# EAGLE design esp8266-somfy-switching (EAGLE 9.6.2)
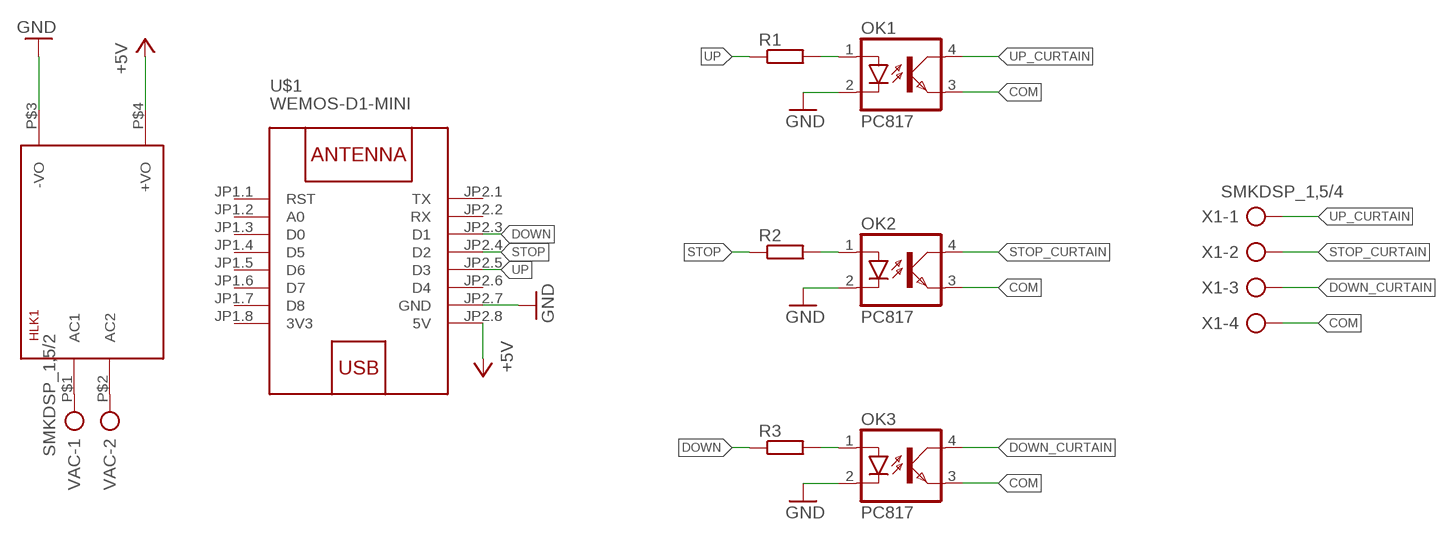
[diagram p0: schematic, sheet 1]

## Parts
HLK1  HLK-PM013W  [HLK-PM01]
OK1  PC817  [DIL04]
OK2  PC817  [DIL04]
OK3  PC817  [DIL04]
R1  R-EU_0207/10  [0207/10]
R2  R-EU_0207/10  [0207/10]
R3  R-EU_0207/10  [0207/10]
U$1  WEMOS-D1-MINI  [WEMOS-D1-MINI]
VAC  SMKDSP_1,5/2  [SMKDSP_1,5/2]
X1  SMKDSP_1,5/4  [SMKDSP_1,5/4]

## Nets
+5V: HLK1.P$4(+VO) U$1.JP2.8(5V)
COM: OK1.3(EMIT) OK2.3(EMIT) OK3.3(EMIT) X1.4
DOWN: R3.1 U$1.JP2.3(D1)
DOWN_CURTAIN: OK3.4(COL) X1.3
GND: HLK1.P$3(-VO) OK1.2(C) OK2.2(C) OK3.2(C) U$1.JP2.7(GND)
N$1: HLK1.P$1(AC1) VAC.1
N$2: HLK1.P$2(AC2) VAC.2
N$3: OK1.1(A) R1.2
N$11: OK2.1(A) R2.2
N$14: OK3.1(A) R3.2
STOP: R2.1 U$1.JP2.4(D2)
STOP_CURTAIN: OK2.4(COL) X1.2
UP: R1.1 U$1.JP2.5(D3)
UP_CURTAIN: OK1.4(COL) X1.1
Unconnected: U$1.JP1.1(RST) U$1.JP1.2(A0) U$1.JP1.3(D0) U$1.JP1.4(D5) U$1.JP1.5(D6) U$1.JP1.6(D7) U$1.JP1.7(D8) U$1.JP2.1(TX) U$1.JP2.2(RX) U$1.JP2.6(D4)

## Power pins joined to a net without a drawn wire
3V3: U$1.JP1.8(3V3)

## Library data of the parts
HLK1 = HLK-PM01:HLK-PM01: Hi-Link Power Supply HLK-PM01 3W Author: Ahmed Said <https://github.com/AhmedSaid/EAGLELibraries>
OK1-OK3 = optocoupler:PC817: SHARP OPTO COUPLER; MPN: PC817X4J000F; OC_FARNELL: 9707727; OC_NEWARK: 97K7059
R1-R3 = resistor:R-EU_: RESISTOR, European symbol
U$1 = diy-modules:WEMOS-D1-MINI: WEMOS D1 mini: Mini Wi-Fi Board based on ESP-8266 device More details can be found here: https://www.wemos.cc/product/d1-mini.html Click here to find device on ebay.com <http://www.ebay.com/sch/wemos+d1+mini+nodemcu>
VAC = con-phoenix-smkdsp:SMKDSP_1,5/2: Printklemme, Nennstrom: 17,5 A, Bemessungsspannung: 250 V, Raster: 5,0 mm Source: http://eshop.phoenixcontact.de .. 1733415.pdf; MF: FARNELL; MPN: 1733570; OC_FARNELL: 3041244; OC_NEWARK: 69C8588
X1 = con-phoenix-smkdsp:SMKDSP_1,5/4: Printklemme, Nennstrom: 17,5 A, Bemessungsspannung: 250 V, Raster: 5,0 mm Source: http://eshop.phoenixcontact.de .. 1733415.pdf; MF: FARNELL; MPN: 1733596; OC_FARNELL: 3041268; OC_NEWARK: 71C4131

## Board
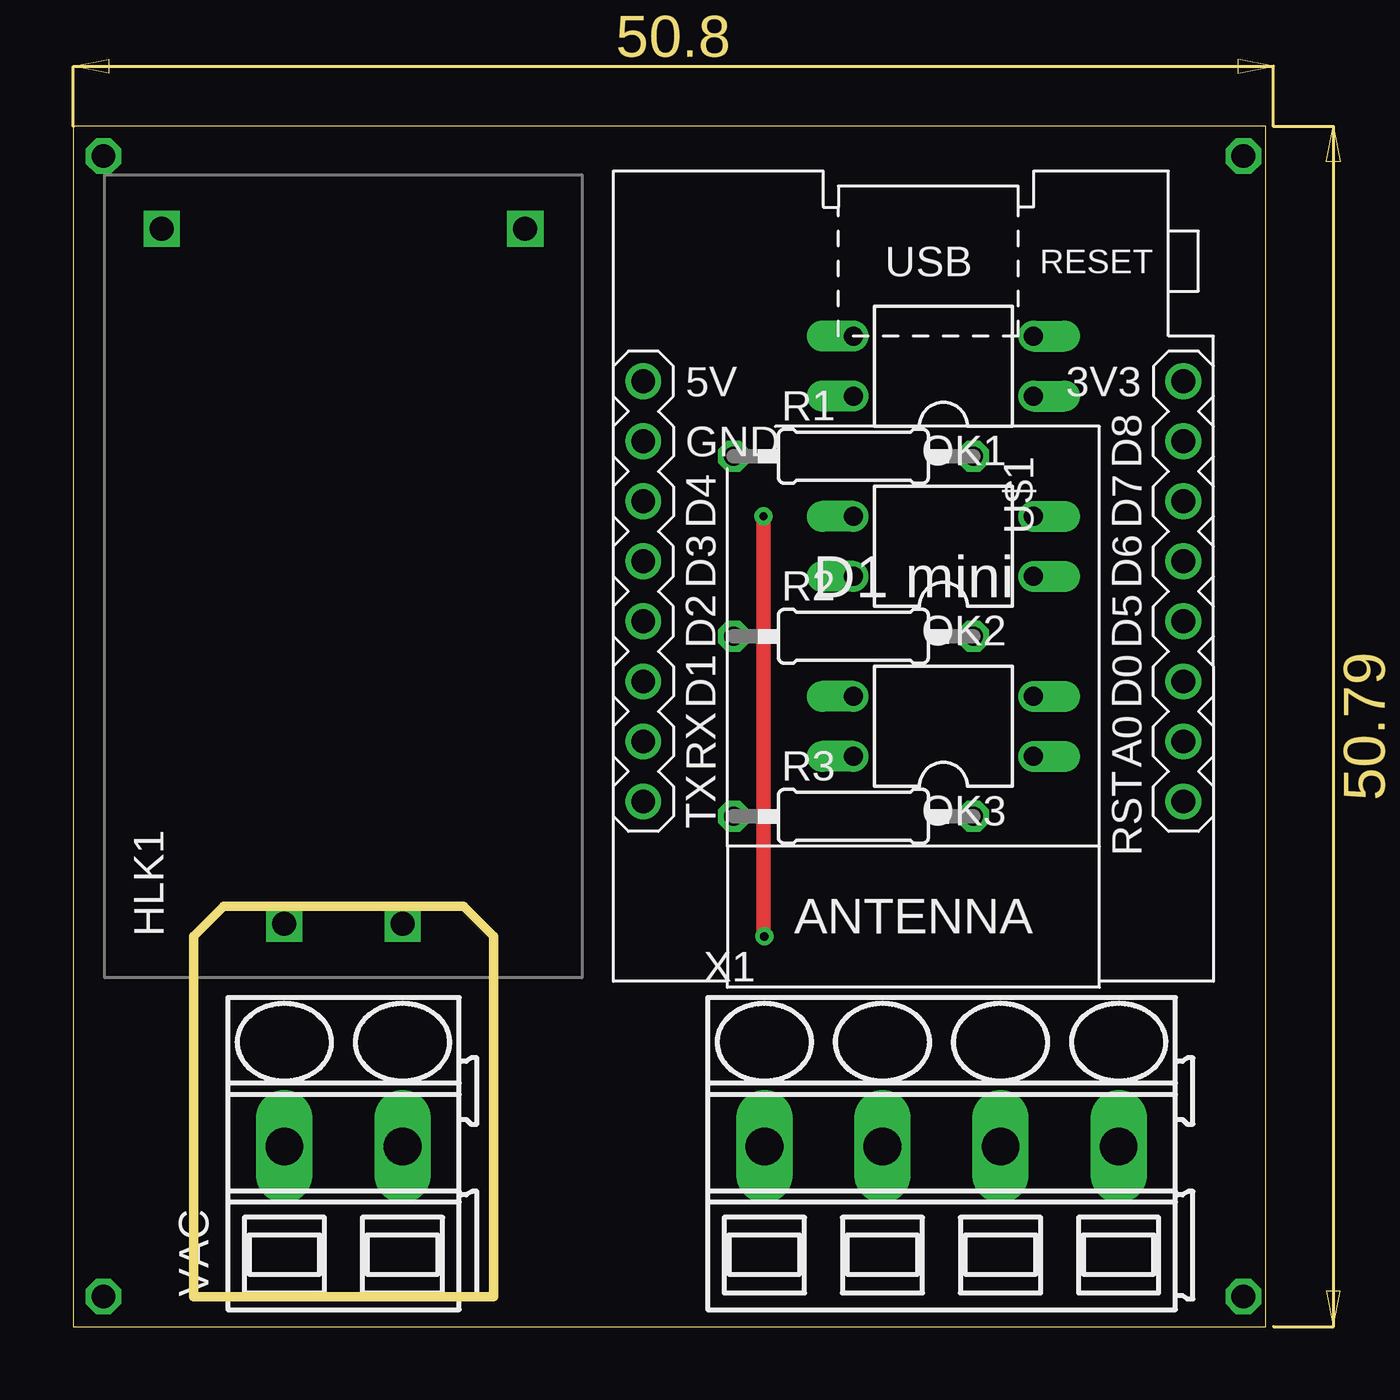
[diagram p1: board, top side]
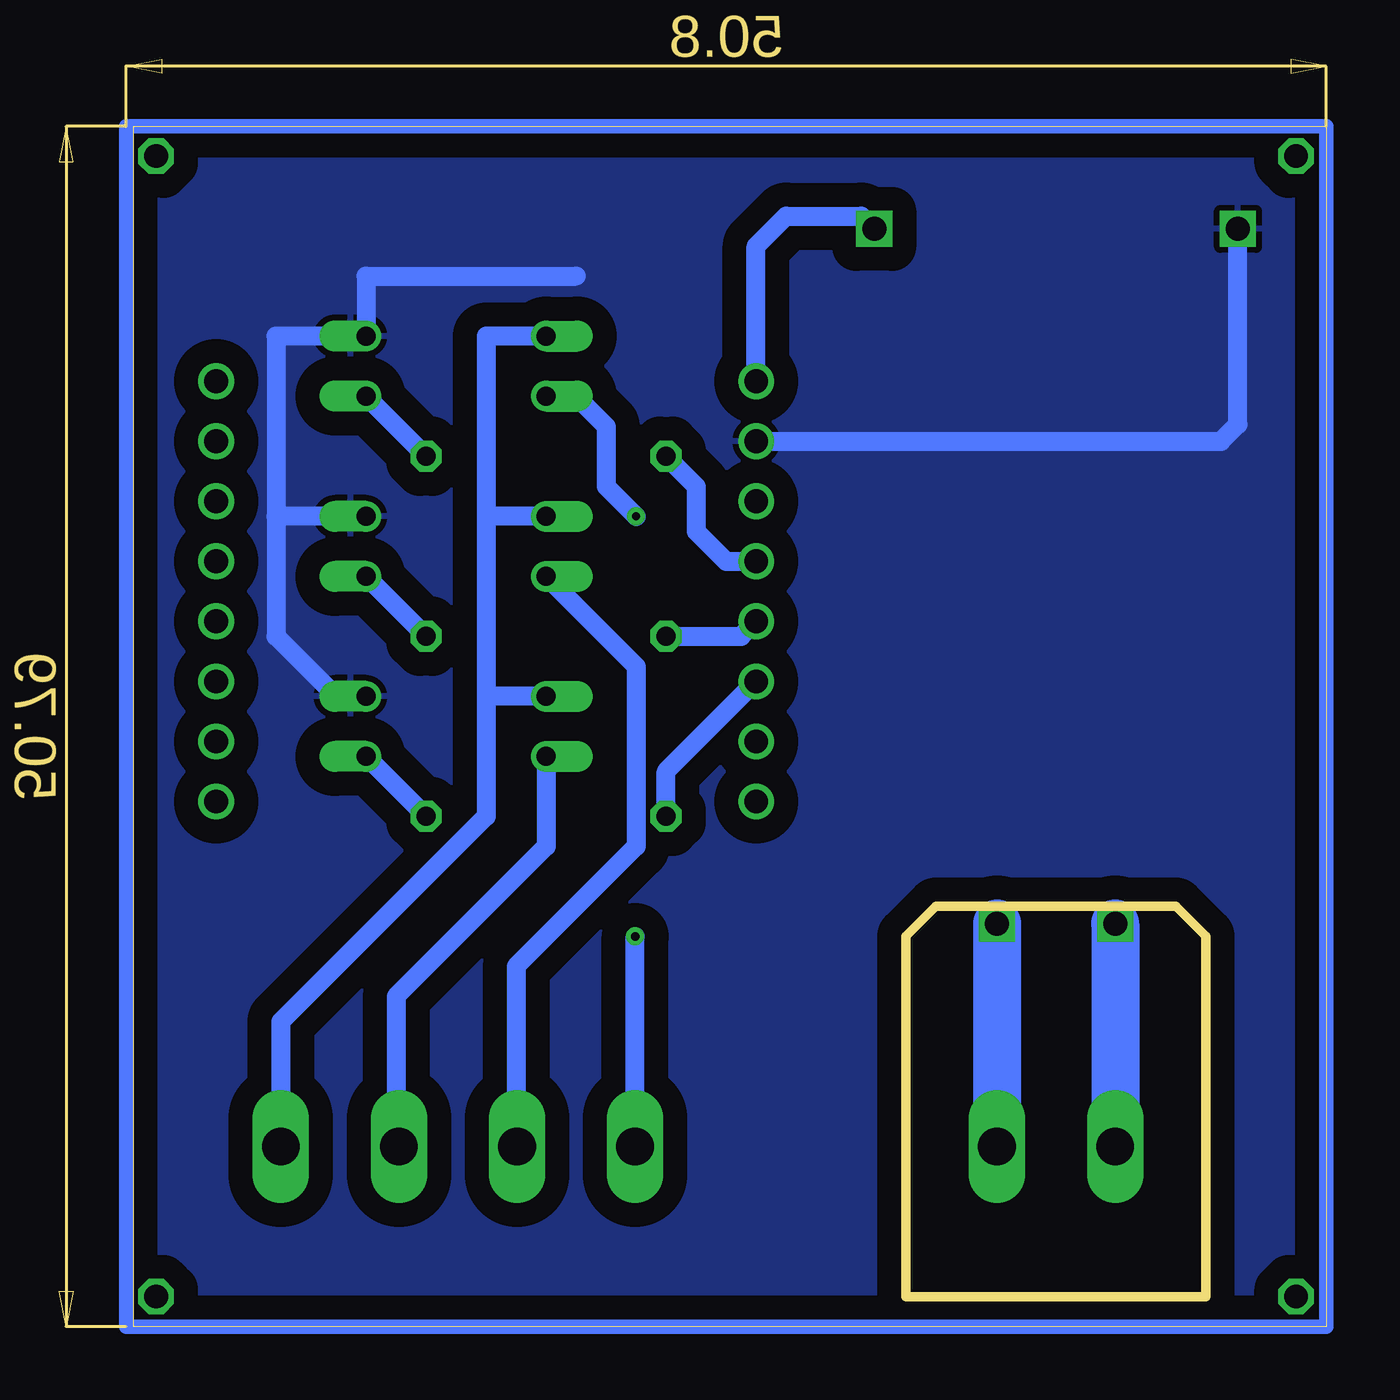
[diagram p2: board, bottom side, seen from below]

Size 50.47 x 50.79 mm. Coordinates in mm from the lower left corner, seen from the top.
Outline: 0,0 50.47,0 50.47,50.79 0,50.79 0,0
Outline: 17.78,1.27 5.08,1.27 5.08,16.51 6.35,17.78 16.51,17.78 17.78,16.51 17.78,1.27
Copper layers (1*16): Top 0.035mm / dielectric 1.5mm / Bottom 0.035mm
Design rules "default": minimum track width 6mil, minimum drill 0.35mm, track to track 6mil, track to pad 6mil, pad to pad 6mil, via to via 6mil, smd to smd 6mil, copper to edge 40mil, drill to drill 6mil, minimum pad ring 10mil, minimum via ring 8mil, stop-mask expansion 4mil, vias tented up to drill 0mil, thermal gap 10mil

### Footprints (pad centres in the part's own frame; a part is rotated, then mirrored left to right if it is on the bottom)
HLK-PM01 = drill 1.016 square: P$1 -14.7,2.5; P$2 -14.7,-2.5; P$3 14.7,7.7; P$4 14.7,-7.7
DIL04 = drill 0.813 offset: 1 -1.27,-3.81; 2 1.27,-3.81; 3 1.27,3.81; 4 -1.27,3.81
0207/10 = drill 0.813 octagon: 1 -5.08,0; 2 5.08,0
WEMOS-D1-MINI = drill 1: JP1.1 -11.43,9.525; JP1.2 -11.43,6.985; JP1.3 -11.43,4.445; JP1.4 -11.43,1.905; JP1.5 -11.43,-0.635; JP1.6 -11.43,-3.175; JP1.7 -11.43,-5.715; JP1.8 -11.43,-8.255; JP2.1 11.43,9.525; JP2.2 11.43,6.985; JP2.3 11.43,4.445; JP2.4 11.43,1.905; JP2.5 11.43,-0.635; JP2.6 11.43,-3.175; JP2.7 11.43,-5.715; JP2.8 11.43,-8.255
SMKDSP_1,5/2 = drill 1.6 pad 1.8 long: 1 -2.5,0; 2 2.5,0
SMKDSP_1,5/4 = drill 1.6 pad 1.8 long: 1 -2.5,0; 2 2.5,0; 3 7.5,0; 4 12.5,0

### Placement (x,y rotation side)
HLK1  11.43,31.75 90 top
OK1  36.83,40.64 90 top
OK2  36.83,33.02 90 top
OK3  36.83,25.4 90 top
R1  33.02,36.83 0 top
R2  33.02,29.21 0 top
R3  33.02,21.59 0 top
U$1  35.56,31.75 180 top
VAC  11.43,7.62 0 top
X1  31.75,7.62 0 top

### Tracks (layer width: path | path; a pad name or v marks a point on that pad's centre or on a via)
+5V
  Bottom 0.813: U$1.JP2.8 24.13,45.72 22.86,46.99 19.67,46.99 HLK1.P$4
COM
  Bottom 0.813: OK3.3 35.56,26.67 | OK2.3 35.56,34.29 | OK1.3 35.56,41.91 35.56,34.29 | 35.56,34.29 35.56,26.67 | 35.56,26.67 35.56,21.59 44.25,12.9 X1.4
DOWN
  Bottom 0.813: R3.1 27.94,23.49 U$1.JP2.3
DOWN_CURTAIN
  Bottom 0.813: OK3.4 33.02,20.32 39.37,13.97 39.37,7.74 X1.3
GND
  Bottom 0.813: OK2.2 44.45,34.29 | 44.45,34.29 44.45,29.21 41.91,26.67 OK3.2 | 44.45,34.29 44.45,41.91 OK1.2 40.64,44.45 31.75,44.45 | U$1.JP2.7 4.45,37.46 3.73,38.18 HLK1.P$3
  pour Bottom (isolate 1.016): 0,50.8 50.8,50.8 50.8,0 0,0
N$1
  Bottom 2.032: HLK1.P$1 VAC.1
N$2
  Bottom 2.032: HLK1.P$2 VAC.2
N$3
  Bottom 0.813: R1.2 OK1.1
N$4  (via drill 1 pad 1.2)
  other vias: 1.27,49.53
N$5  (via drill 1 pad 1.2)
  other vias: 49.53,49.53
N$6  (via drill 1 pad 1.2)
  other vias: 49.53,1.27
N$7  (via drill 1 pad 1.2)
  other vias: 1.27,1.27
N$8
  Bottom 0.61: 0,50.8 50.8,50.8 50.8,0 0,0 0,50.8
N$11
  Bottom 0.813: OK2.1 R2.2
N$14
  Bottom 0.813: OK3.1 R3.2
STOP
  Bottom 0.813: R2.1 24.77,29.21 U$1.JP2.4
STOP_CURTAIN
  Bottom 0.813: OK2.4 29.21,27.94 29.21,20.32 34.29,15.24 34.29,7.66 X1.2
UP
  Bottom 0.813: R1.1 26.67,35.56 26.67,33.66 25.4,32.38 U$1.JP2.5
UP_CURTAIN  (via drill 0.35)
  Top 0.61: v29.21,34.29 29.21,16.51 v29.25,16.51
  Bottom 0.813: X1.1 v29.25,16.51 | OK1.4 31.75,39.37 30.48,38.1 30.48,35.56 v29.21,34.29